# EAGLE design integrated_v1 (EAGLE 9.6.2)
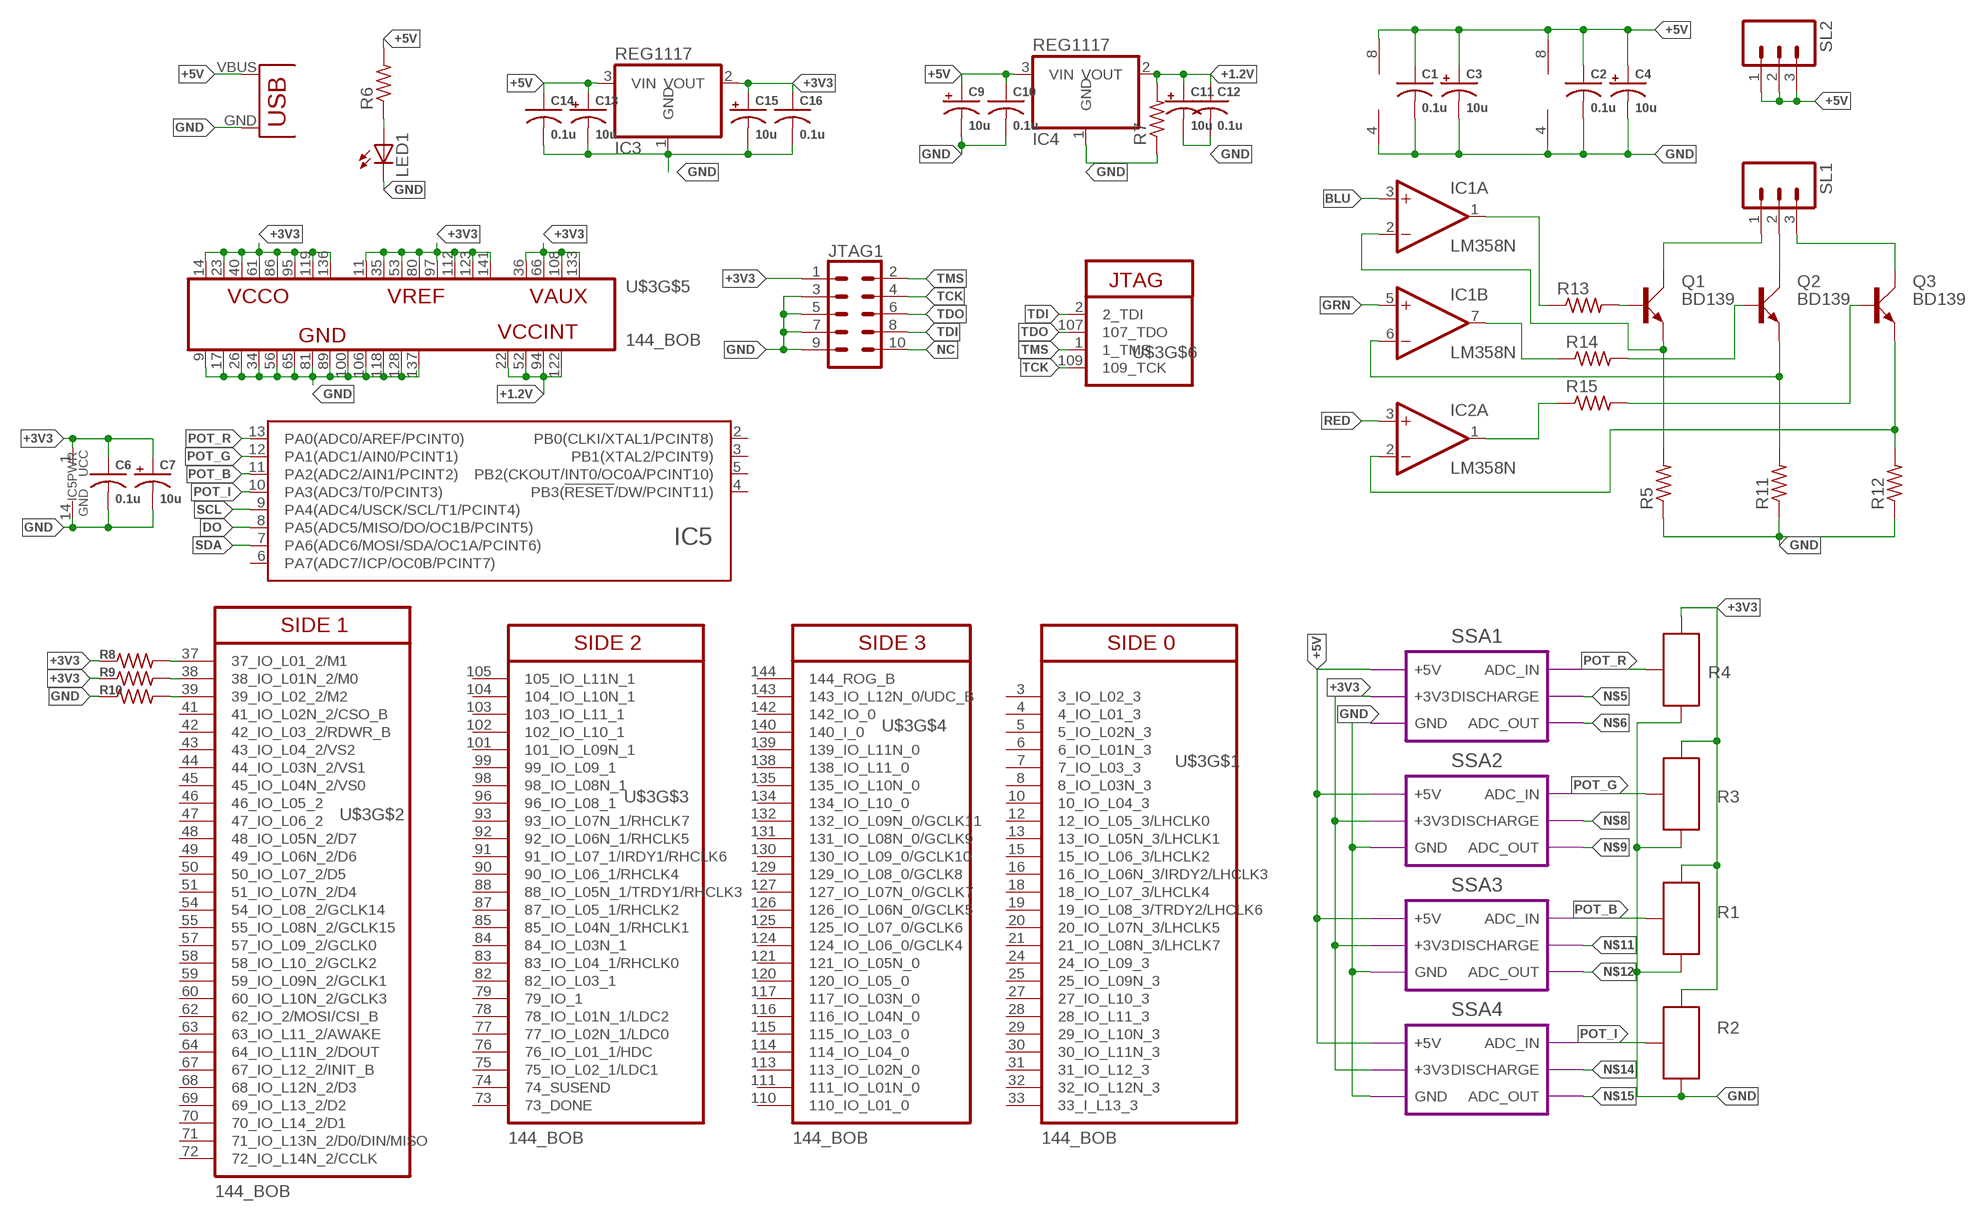
[diagram p0: schematic, sheet 1]

## Parts
C1  0.1u  CAP0603  [C0603]
C2  0.1u  CAP0603  [C0603]
C3  10u  CAP_POL_16V  [B/3528-21R]
C4  10u  CAP_POL_16V  [B/3528-21R]
C6  0.1u  CAP0603  [C0603]
C7  10u  CAP_POL_16V  [B/3528-21R]
C9  10u  CAP_POL_16V  [B/3528-21R]
C10  0.1u  CAP0603  [C0603]
C11  10u  CAP_POL_16V  [B/3528-21R]
C12  0.1u  CAP0603  [C0603]
C13  10u  CAP_POL_16V  [B/3528-21R]
C14  0.1u  CAP0603  [C0603]
C15  10u  CAP_POL_16V  [B/3528-21R]
C16  0.1u  CAP0603  [C0603]
IC1  LM358N  [DIL08]
IC2  LM358N  [DIL08]
IC3  REG1117  [SOT223]
IC4  REG1117  [SOT223]
IC5  ATTINY24/44/84-SSU  [SOIC14]
JTAG1  CONN_05X2  [2X5-SHROUDED_LOCK_PROPER]
LED1  LED3MM  [LED3MM]
Q1  BD139  [TO126AV]
Q2  BD139  [TO126AV]
Q3  BD139  [TO126AV]
R1  POTNORMAL  [RJ9W]
R2  POTNORMAL  [RJ9W]
R3  POTNORMAL  [RJ9W]
R4  POTNORMAL  [RJ9W]
R5  4.7  R-US_0411/15  [0411/15]
R6  R-US_0204/7  [0204/7]
R7  R-US_0204/7  [0204/7]
R8  RESISTOR0805  [R0805]
R9  RESISTOR0805  [R0805]
R10  RESISTOR0805  [R0805]
R11  R-US_0411/15  [0411/15]
R12  R-US_0411/15  [0411/15]
R13  R-US_0204/7  [0204/7]
R14  R-US_0204/7  [0204/7]
R15  R-US_0204/7  [0204/7]
SL1  M03  [03P]
SL2  M03  [03P]
U$3  144_BOB  [144_BOB]
U$4  USB(POWER)  [USB(POWER)]

## Module instances
SSA1 = SINGLESLOPEADC
SSA2 = SINGLESLOPEADC
SSA3 = SINGLESLOPEADC
SSA4 = SINGLESLOPEADC

## Nets
+1.2V: C11.+ C12.1 IC4.2(VOUT) R7.2 U$3.22(22_VCCINT) U$3.52(52_VCCINT) U$3.94(94_VCCINT) U$3.122(122_VCCINT)
+3V3: C6.1 C7.+ C15.+ C16.1 IC3.2(VOUT) IC5.1(UCC) JTAG1.1 R1.E R2.E R3.E R4.E R8.1 R9.1 U$3.11(11_VREF) U$3.14(14_VCCO) U$3.23(23_VCCO) U$3.35(35_VREF) U$3.36(36_VAUX) U$3.40(40_VCCO) U$3.53(53_VREF) U$3.61(61_VCCO) U$3.66(66_VAUX) U$3.80(80_VREF) U$3.86(86_VCCO) U$3.95(95_VCCO) U$3.97(97_VREF) U$3.108(108_VAUX) U$3.112(112_VREF) U$3.119(119_VCCO) U$3.123(123_VREF) U$3.133(133_VAUX) U$3.136(136_VCCO) U$3.141(141_VREF) ; port SSA1.+3V3 SSA2.+3V3 SSA3.+3V3 SSA4.+3V3
+5V: C1.1 C2.1 C3.+ C4.+ C9.+ C10.1 C13.+ C14.1 IC1.8(P:V+) IC2.8(P:V+) IC3.3(VIN) IC4.3(VIN) R6.2 SL2.1 SL2.2 SL2.3 U$4.VBUS(VCC) ; port SSA1.+5V SSA2.+5V SSA3.+5V SSA4.+5V
BLU: IC1.3(A:+IN)
DO: IC5.8(PA5(ADC5/MISO/DO/OC1B/PCINT5))
GND: C1.2 C2.2 C3.- C4.- C6.2 C7.- C9.- C10.2 C11.- C12.2 C13.- C14.2 C15.- C16.2 IC1.4(P:V-) IC2.4(P:V-) IC3.1(GND) IC4.1(GND) IC5.14(GND) JTAG1.3 JTAG1.5 JTAG1.7 JTAG1.9 LED1.K(C) R1.A R2.A R3.A R4.A R5.1 R7.1 R10.1 R11.1 R12.1 U$3.9(9_GND) U$3.17(17_GND) U$3.26(26_GND) U$3.34(34_GND) U$3.56(56_GND) U$3.65(65_GND) U$3.81(81_GND) U$3.89(89_GND) U$3.100(100_GND) U$3.106(106_GND) U$3.118(118_GND) U$3.128(128_GND) U$3.137(137_GND) U$4.GND ; port SSA1.GND SSA3.GND SSA4.GND SSA2.GND
GRN: IC1.5(B:+IN)
N$1: Q1.C SL1.1
N$2: Q3.C SL1.3
N$3: Q2.C SL1.2
N$5: port SSA1.DISCHARGE
N$6: port SSA1.ADC_OUT
N$8: port SSA2.DISCHARGE
N$9: port SSA2.ADC_OUT
N$11: port SSA3.DISCHARGE
N$12: port SSA3.ADC_OUT
N$14: port SSA4.DISCHARGE
N$15: port SSA4.ADC_OUT
N$16: Q1.B R13.2
N$17: Q2.B R14.2
N$18: Q3.B R15.2
N$19: IC1.6(B:-IN) Q2.E R11.2
N$20: IC1.1(A:OUT) R13.1
N$21: IC1.7(B:OUT) R14.1
N$22: IC2.1(A:OUT) R15.1
N$23: IC1.2(A:-IN) Q1.E R5.2
N$24: LED1.A R6.1
N$25: R8.2 U$3.37(37_IO_L01_2/M1)
N$26: R9.2 U$3.38(38_IO_L01N_2/M0)
N$27: R10.2 U$3.39(39_IO_L02_2/M2)
N$32: IC2.2(A:-IN) Q3.E R12.2
NC: JTAG1.10
POT_B: IC5.11(PA2(ADC2/AIN1/PCINT2)) R1.S ; port SSA3.ADC_IN
POT_G: IC5.12(PA1(ADC1/AIN0/PCINT1)) R3.S ; port SSA2.ADC_IN
POT_I: IC5.10(PA3(ADC3/T0/PCINT3)) R2.S ; port SSA4.ADC_IN
POT_R: IC5.13(PA0(ADC0/AREF/PCINT0)) R4.S ; port SSA1.ADC_IN
RED: IC2.3(A:+IN)
SCL: IC5.9(PA4(ADC4/USCK/SCL/T1/PCINT4))
SDA: IC5.7(PA6(ADC6/MOSI/SDA/OC1A/PCINT6))
TCK: JTAG1.4 U$3.109(109_TCK)
TDI: JTAG1.8 U$3.2(2_TDI)
TDO: JTAG1.6 U$3.107(107_TDO)
TMS: JTAG1.2 U$3.1(1_TMS)
Unconnected: IC2.5(B:+IN) IC2.6(B:-IN) IC2.7(B:OUT) IC5.2(PB0(CLKI/XTAL1/PCINT8)) IC5.3(PB1(XTAL2/PCINT9)) IC5.4(PB3(!RESET!/DW/PCINT11)) IC5.5(PB2(CKOUT/INT0/OC0A/PCINT10)) IC5.6(PA7(ADC7/ICP/OC0B/PCINT7)) U$3.3(3_IO_L02_3) U$3.4(4_IO_L01_3) U$3.5(5_IO_L02N_3) U$3.6(6_IO_L01N_3) U$3.7(7_IO_L03_3) U$3.8(8_IO_L03N_3) U$3.10(10_IO_L04_3) U$3.12(12_IO_L05_3/LHCLK0) U$3.13(13_IO_L05N_3/LHCLK1) U$3.15(15_IO_L06_3/LHCLK2) U$3.16(16_IO_L06N_3/IRDY2/LHCLK3) U$3.18(18_IO_L07_3/LHCLK4) U$3.19(19_IO_L08_3/TRDY2/LHCLK6) U$3.20(20_IO_L07N_3/LHCLK5) U$3.21(21_IO_L08N_3/LHCLK7) U$3.24(24_IO_L09_3) U$3.25(25_IO_L09N_3) U$3.27(27_IO_L10_3) U$3.28(28_IO_L11_3) U$3.29(29_IO_L10N_3) U$3.30(30_IO_L11N_3) U$3.31(31_IO_L12_3) U$3.32(32_IO_L12N_3) U$3.33(33_I_L13_3) U$3.41(41_IO_L02N_2/CSO_B) U$3.42(42_IO_L03_2/RDWR_B) U$3.43(43_IO_L04_2/VS2) U$3.44(44_IO_L03N_2/VS1) U$3.45(45_IO_L04N_2/VS0) U$3.46(46_IO_L05_2) U$3.47(47_IO_L06_2) U$3.48(48_IO_L05N_2/D7) U$3.49(49_IO_L06N_2/D6) U$3.50(50_IO_L07_2/D5) U$3.51(51_IO_L07N_2/D4) U$3.54(54_IO_L08_2/GCLK14) U$3.55(55_IO_L08N_2/GCLK15) U$3.57(57_IO_L09_2/GCLK0) U$3.58(58_IO_L10_2/GCLK2) U$3.59(59_IO_L09N_2/GCLK1) U$3.60(60_IO_L10N_2/GCLK3) U$3.62(62_IO_2/MOSI/CSI_B) U$3.63(63_IO_L11_2/AWAKE) U$3.64(64_IO_L11N_2/DOUT) U$3.67(67_IO_L12_2/INIT_B) U$3.68(68_IO_L12N_2/D3) U$3.69(69_IO_L13_2/D2) U$3.70(70_IO_L14_2/D1) U$3.71(71_IO_L13N_2/D0/DIN/MISO) U$3.72(72_IO_L14N_2/CCLK) U$3.73(73_DONE) U$3.74(74_SUSEND) U$3.75(75_IO_L02_1/LDC1) U$3.76(76_IO_L01_1/HDC) U$3.77(77_IO_L02N_1/LDC0) U$3.78(78_IO_L01N_1/LDC2) U$3.79(79_IO_1) U$3.82(82_IO_L03_1) U$3.83(83_IO_L04_1/RHCLK0) U$3.84(84_IO_L03N_1) U$3.85(85_IO_L04N_1/RHCLK1) U$3.87(87_IO_L05_1/RHCLK2) U$3.88(88_IO_L05N_1/TRDY1/RHCLK3) U$3.90(90_IO_L06_1/RHCLK4) U$3.91(91_IO_L07_1/IRDY1/RHCLK6) U$3.92(92_IO_L06N_1/RHCLK5) U$3.93(93_IO_L07N_1/RHCLK7) U$3.96(96_IO_L08_1) U$3.98(98_IO_L08N_1) U$3.99(99_IO_L09_1) U$3.101(101_IO_L09N_1) U$3.102(102_IO_L10_1) U$3.103(103_IO_L11_1) U$3.104(104_IO_L10N_1) U$3.105(105_IO_L11N_1) U$3.110(110_IO_L01_0) U$3.111(111_IO_L01N_0) U$3.113(113_IO_L02N_0) U$3.114(114_IO_L04_0) U$3.115(115_IO_L03_0) U$3.116(116_IO_L04N_0) U$3.117(117_IO_L03N_0) U$3.120(120_IO_L05_0) U$3.121(121_IO_L05N_0) U$3.124(124_IO_L06_0/GCLK4) U$3.125(125_IO_L07_0/GCLK6) U$3.126(126_IO_L06N_0/GCLK5) U$3.127(127_IO_L07N_0/GCLK7) U$3.129(129_IO_L08_0/GCLK8) U$3.130(130_IO_L09_0/GCLK10) U$3.131(131_IO_L08N_0/GCLK9) U$3.132(132_IO_L09N_0/GCLK11) U$3.134(134_IO_L10_0) U$3.135(135_IO_L10N_0) U$3.138(138_IO_L11_0) U$3.139(139_IO_L11N_0) U$3.140(140_I_0) U$3.142(142_IO_0) U$3.143(143_IO_L12N_0/UDC_B) U$3.144(144_ROG_B)

## Library data of the parts
C1 C2 C6 C10 C12 C14 C16 = CEDT_JANUARY_2015_v5:CAP
C3 C4 C7 C9 C11 C13 C15 = CEDT_JANUARY_2015_v5:CAP_POL
IC1 IC2 = CEDT_JANUARY_2015:LM358: OP AMP also LM158; LM258; LM2904 Source: http://cache.national.com/ds/LM/LM158.pdf
IC3 IC4 = CEDT_JANUARY_2015_v5:REG1117: 800mA and 1A Low Dropout (LDO) Positive Regulator 1.8V, 2.5V, 2.85V, 3.3V, 5V, and Adj
IC5 = atmel_tiny24-44-84tiny48-88mega48-88-168-328:ATTINY24/44/84
JTAG1 = SparkFun-Connectors_v3:CONN_05X2: Multi connection point. Often used as Generic Header-pin footprint for 0.1 inch spaced/style header connections For AVR SPI programming port, see special device with nice symbol: "AVR_SPI_PROG_5x2.dev" You can populate with any combo of single row headers, but if you'd like an exact match, check these: 2x5 AVR ICSP Male Header (PRT-00778) 2x5 Pin Shrouded Header (PRT-08506) On any of the 0.1 inch spaced packages, you can populate with these: Break Away Headers - Straight (PRT-00116) Break Away Male Headers - Right Angle (PRT-00553) Female Headers (PRT-00115) Break Away Headers - Machine Pin (PRT-00117) Break Away Female Headers - Swiss Machine Pin (PRT-00743) Special note: the shrouded connector mates well with our 5x2 ribbon cables: 2x5 Pin IDC Ribbon Cable (PRT-08535)
LED1 = CEDT_JANUARY_2015_v5:LED
Q1-Q3 = transistor-power:BD139: NPN TRANSISTOR
R1-R4 = CEDTv78:POT
R5 R11-R15 = resistor:R-US_: RESISTOR, American symbol
R6 R7 = rcl:R-US_: RESISTOR, American symbol; SPICEPREFIX: R
R8-R10 = CEDT_JANUARY_2015_v5:RESISTOR
SL1 SL2 = con-amp-quick:M03: AMP QUICK CONNECTOR; OC_FARNELL: unknown; OC_NEWARK: unknown
U$3 = Suprio_Lib:144_BOB
U$4 = CEDT_JANUARY_2015_v5:USB(POWER)

## Module SINGLESLOPEADC
Ports: +5V(pwr) +3V3(pwr) GND(pwr) ADC_IN(in) DISCHARGE(in) ADC_OUT(out)
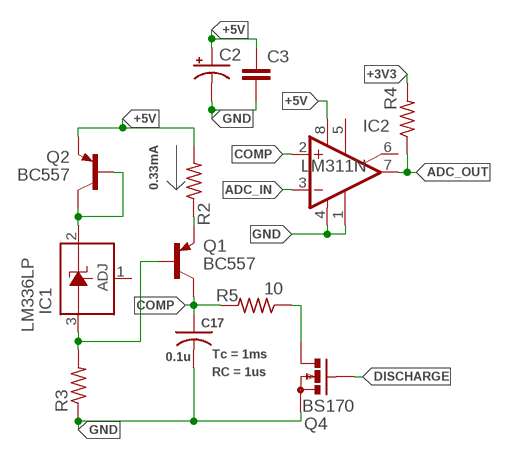
[diagram p1: schematic, module SINGLESLOPEADC, sheet 1]

### Parts
C2  CPOL-USE2.5-5  [E2,5-5]
C3  C-EU025-024X044  [C025-024X044]
C17  0.1u  CAP0603  [C0603]
IC1  LM336LP  [TO92]
IC2  LM311N  [DIL08]
Q1  BC557  PNP_BC557*TO92  [TO92]
Q2  BC557  PNP_BC557*TO92  [TO92]
Q4  BS170  [SOT54E]
R2  R-US_0204/7  [0204/7]
R3  R-US_0204/7  [0204/7]
R4  R-US_0204/7  [0204/7]
R5  10  RESISTOR0207/7  [0207/7]

### Nets
+3V3: R4.2
+5V: C2.+ C3.1 IC2.8(V+) Q2.3(E) R2.2
ADC_IN: IC2.3(-IN)
ADC_OUT: IC2.7(OUT) R4.1
COMP: C17.1 IC2.2(+IN) Q1.1(C) R5.2
DISCHARGE: Q4.G
GND: C2.- C3.2 C17.2 IC2.1(GND) IC2.4(V-) Q4.S R3.1
N$2: Q1.3(E) R2.1
N$3: IC1.2(C) Q2.1(C) Q2.2(B)
N$4: IC1.3(A) Q1.2(B) R3.2
N$5: Q4.D R5.1
Unconnected: IC1.1(ADJ) IC2.5(ON) IC2.6(ON/STR)

### Notes on the sheet
- 0.33mA
- Tc = 1ms
- RC = 1us

### Library data of the parts
C2 = rcl:CPOL-US: POLARIZED CAPACITOR, American symbol; SPICEPREFIX: C
C3 = rcl:C-EU: CAPACITOR, European symbol; SPICEPREFIX: C
C17 = CEDT_JANUARY_2015_v5:CAP
IC1 = linear:LM336: 2.5-V INTEGRATED REFERENCE CIRCUITS LM236 Source: http://focus.ti.com/lit/ds/symlink/lm336-2.5.pdf
IC2 = linear:LM311: COMPARATOR
Q1 Q2 = Transistor:PNP_: PNP - Popular parts; CATEGORY: Transistor; SUB-CATEGORY: BJT; TYPE: PNP
Q4 = transistor-small-signal:BS170: N-CHANNEL MOS FET
R2-R4 = rcl:R-US_: RESISTOR, American symbol; SPICEPREFIX: R
R5 = CEDT_JANUARY_2015_v5 (1):RESISTOR

## Net classes
0 default: width 0.406 mm

## Board
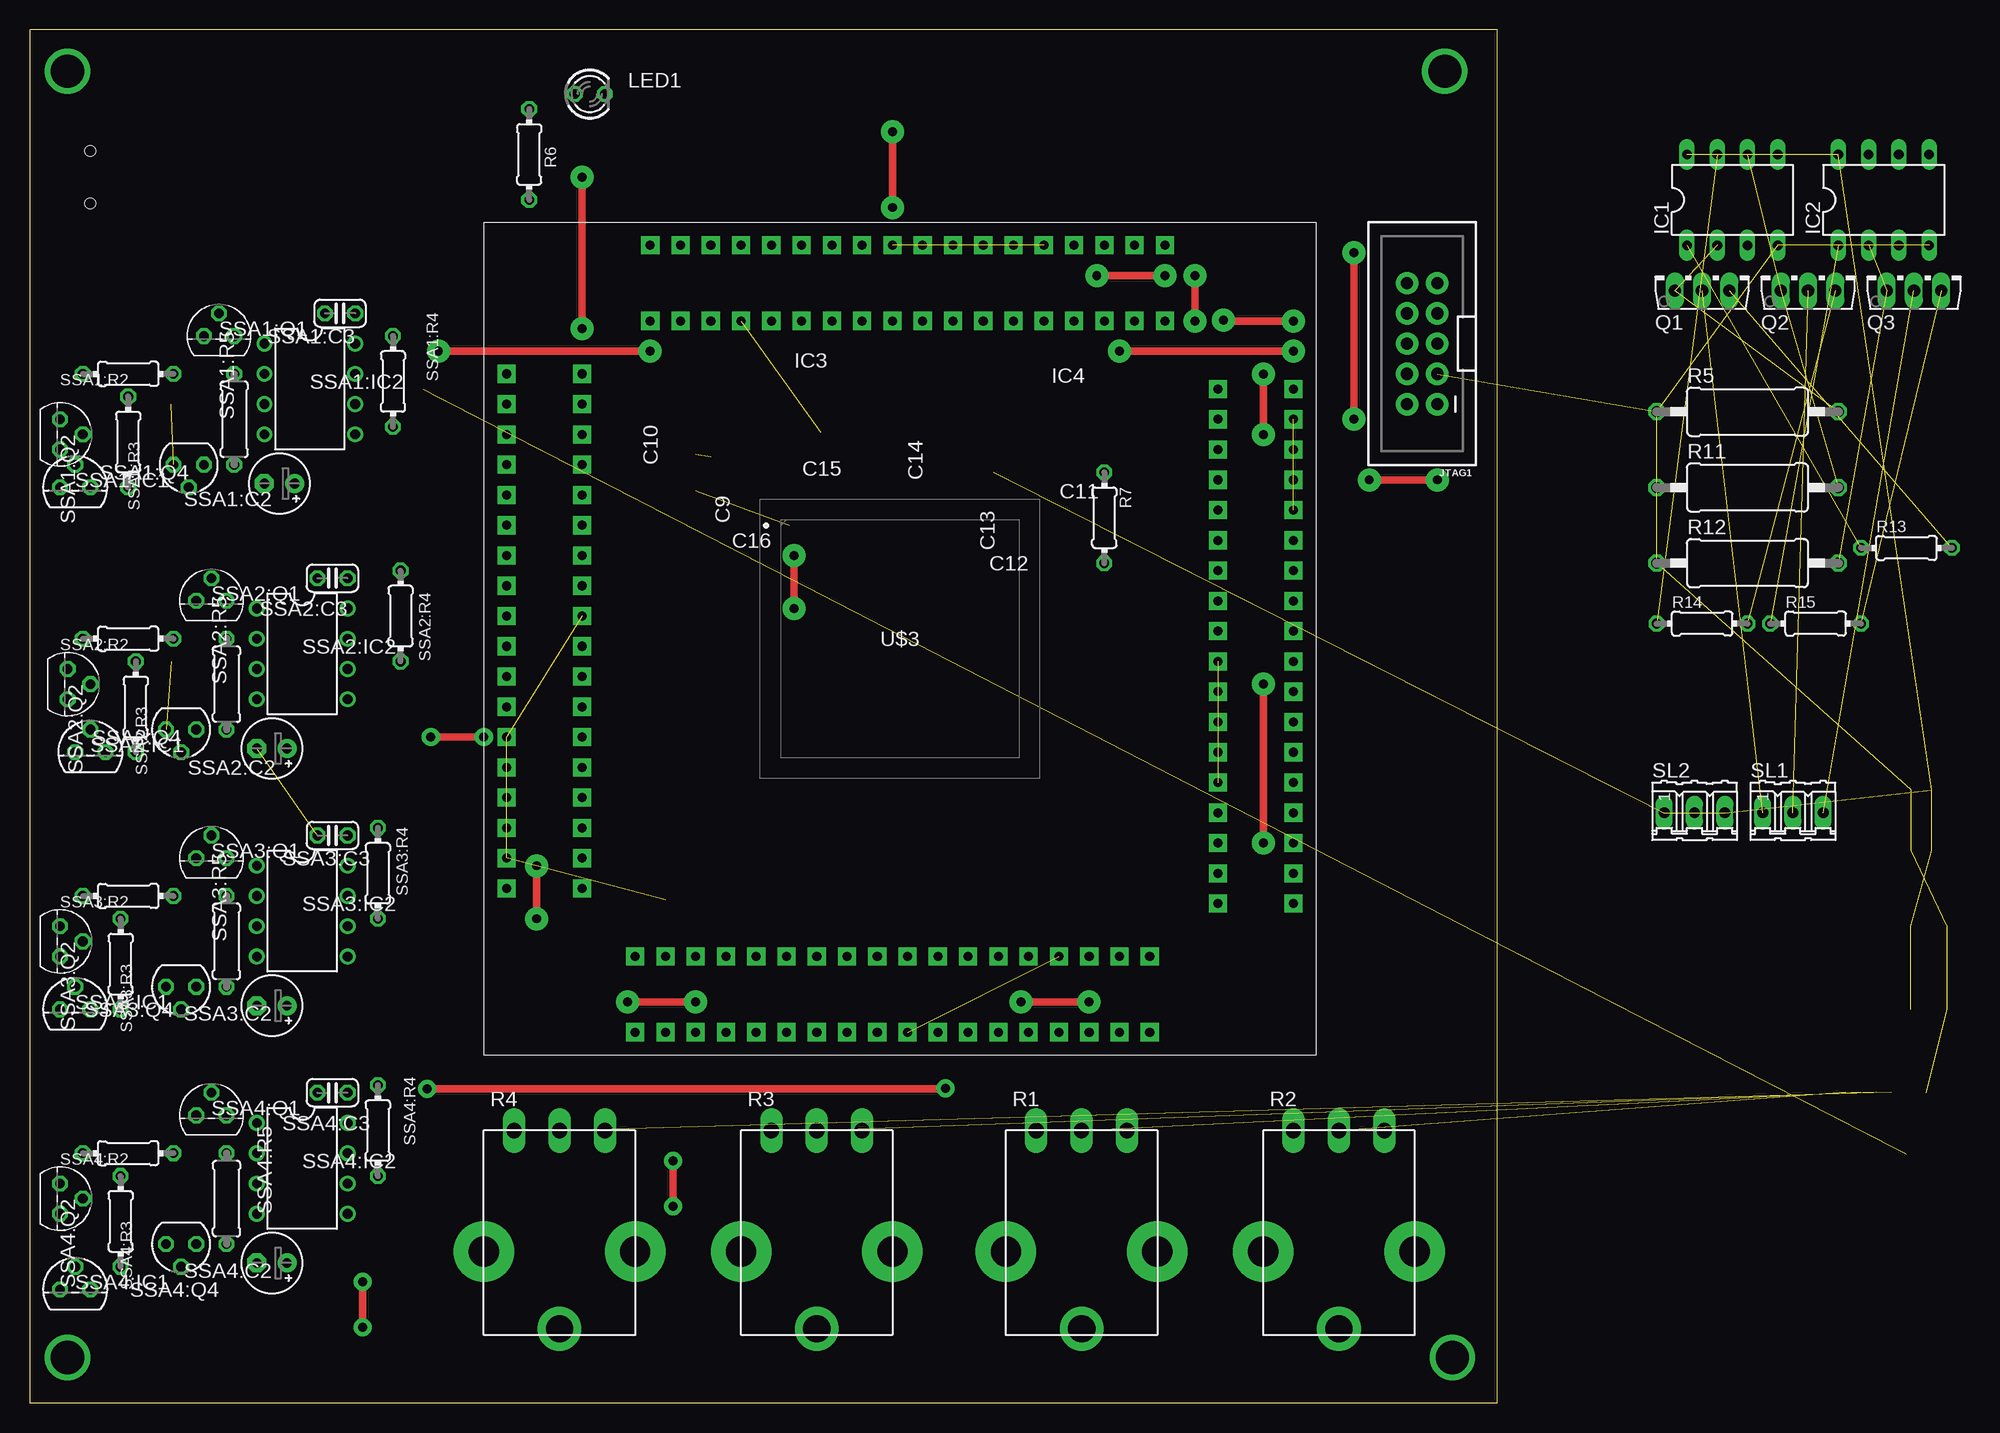
[diagram p2: board, top side]
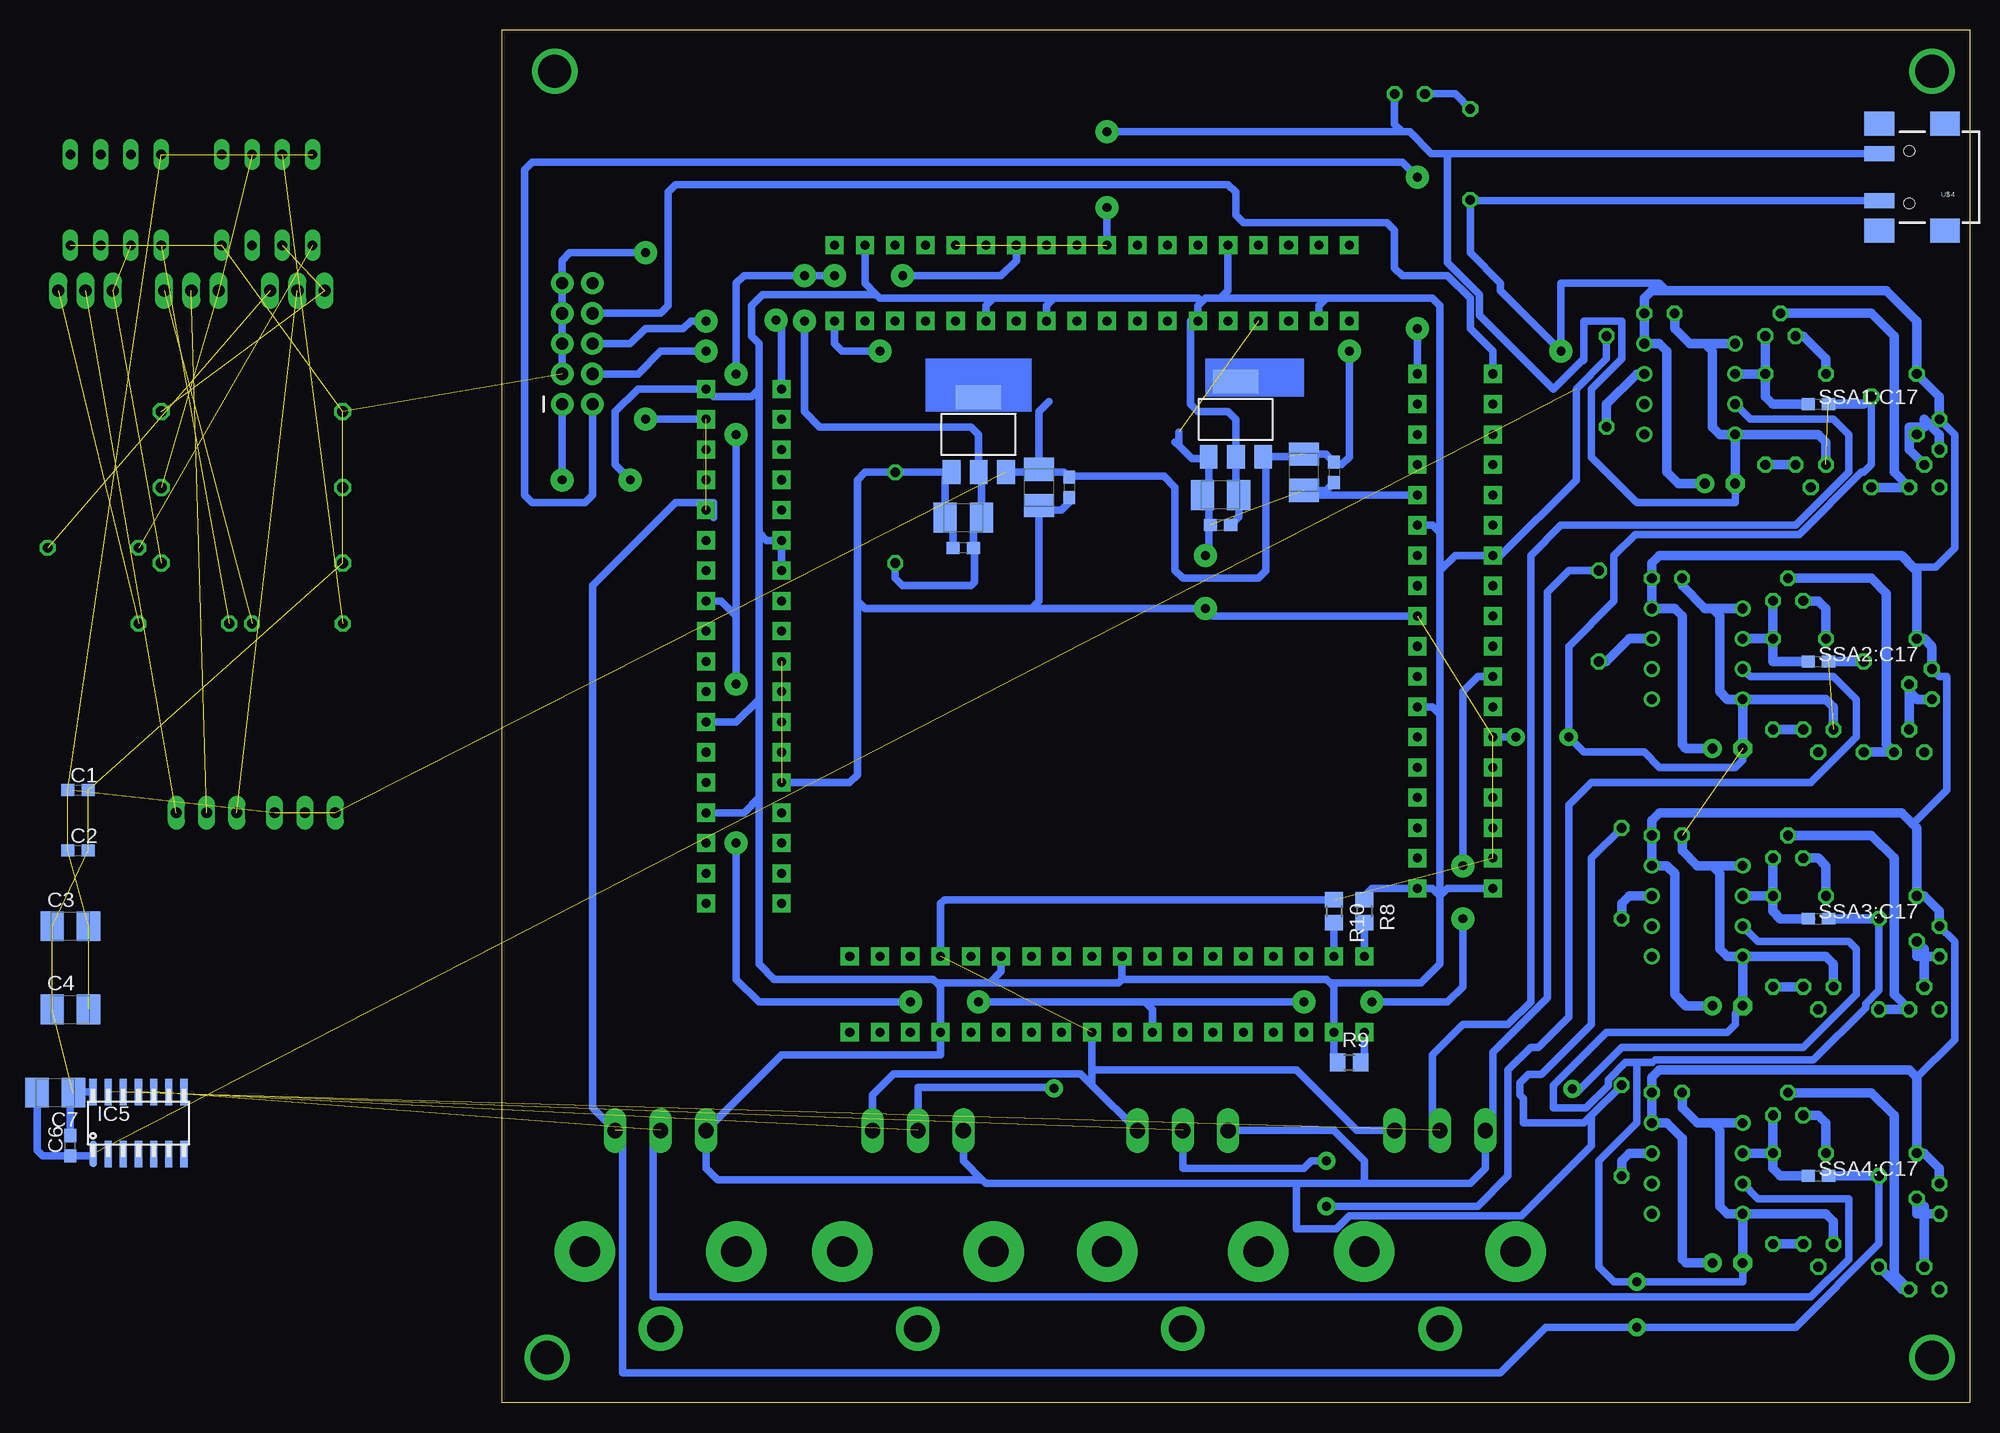
[diagram p3: board, bottom side, seen from below]

Size 123.17 x 115.24 mm. Coordinates in mm from the lower left corner, seen from the top.
Outline: 0,0 123.17,0 123.17,115.24 0,115.24 0,0
Copper layers (1*16): Top 0.035mm / dielectric 1.5mm / Bottom 0.035mm
Design rules "default": minimum track width 6mil, minimum drill 0.35mm, track to track 6mil, track to pad 6mil, pad to pad 6mil, via to via 6mil, smd to smd 6mil, copper to edge 40mil, drill to drill 6mil, minimum pad ring 10mil, minimum via ring 8mil, stop-mask expansion 4mil, vias tented up to drill 0mil, thermal gap 10mil

### Footprints (pad centres in the part's own frame; a part is rotated, then mirrored left to right if it is on the bottom)
C0603 = smd 1.1 x 1: 1 -0.85,0; 2 0.85,0
B/3528-21R = smd 1.95 x 2.5: + 1.525,0; - -1.525,0
DIL08 = drill 0.813 long: 1 -3.81,-3.81; 2 -1.27,-3.81; 3 1.27,-3.81; 4 3.81,-3.81; 5 3.81,3.81; 6 1.27,3.81; 7 -1.27,3.81; 8 -3.81,3.81
SOT223 = smd 1.499 x 2.007: 1 -2.261,-3.15; 2 0.025,-3.15; 3 2.311,-3.15 | smd 3.81 x 2.007: 4 0,3.15
SOIC14 = smd 0.61 x 2.21: 1 -3.81,-2.603; 2 -2.54,-2.603; 3 -1.27,-2.603; 4 0,-2.603; 5 1.27,-2.603; 6 2.54,-2.603; 7 3.81,-2.603; 8 3.81,2.603; 9 2.54,2.603; 10 1.27,2.603; 11 0,2.603; 12 -1.27,2.603; 13 -2.54,2.603; 14 -3.81,2.603
2X5-SHROUDED_LOCK_PROPER = drill 1.016 pad 1.88: 1 -1.27,5.08; 2 1.27,5.08; 3 -1.27,2.54; 4 1.27,2.54; 5 -1.27,0; 6 1.27,0; 7 -1.27,-2.54; 8 1.27,-2.54; 9 -1.27,-5.08; 10 1.27,-5.08
LED3MM = drill 0.813 octagon: A -1.27,0; K 1.27,0
TO126AV = drill 1.016 long: B 2.286,-1.27; C 0,-1.27; E -2.286,-1.27
RJ9W = drill 1.27 long: A 3.81,8.255; E -3.81,8.255; S 0,8.255 | drill 2.286 pad 3.658: P$1 0,-8.382 | drill 2.54 pad 5.08: P$3 6.35,-1.905; P$4 -6.35,-1.905
0411/15 = drill 0.914 octagon: 1 -7.62,0; 2 7.62,0
0204/7 = drill 0.813 octagon: 1 -3.81,0; 2 3.81,0
R0805 = smd 1.3 x 1.5: 1 -0.95,0; 2 0.95,0
03P = drill 0.914 long: 1 -2.54,0; 2 0,0; 3 2.54,0
E2,5-5 = drill 0.813 pad 1.6: + -1.27,0 | drill 0.813 pad 1.6 octagon: - 1.27,0
C025-024X044 = drill 0.813 octagon: 1 -1.27,0; 2 1.27,0
TO92 = drill 0.813 octagon: 1 -1.27,0; 2 0,1.905; 3 1.27,0
DIL08' = drill 0.813 pad 1.27: 1 -3.81,-3.81; 2 -1.27,-3.81; 3 1.27,-3.81; 4 3.81,-3.81; 5 3.81,3.81; 6 1.27,3.81; 7 -1.27,3.81; 8 -3.81,3.81
TO92' = drill 0.813 octagon: 1 1.27,0; 2 0,1.905; 3 -1.27,0
SOT54E = drill 0.813 octagon: D -1.27,0; G 0,1.905; S 1.27,0
0207/7 = drill 0.813 octagon: 1 -3.81,0; 2 3.81,0
144_BOB = drill 0.762 pad 1.524 square: 1 -26.67,21.59; 2 -33.02,21.59; 3 -26.67,19.05; 4 -33.02,19.05; 5 -26.67,16.51; 6 -33.02,16.51; 7 -26.67,13.97; 8 -33.02,13.97; 9 -26.67,11.43; 10 -33.02,11.43; 11 -26.67,8.89; 12 -33.02,8.89; 13 -26.67,6.35; 14 -33.02,6.35; 15 -26.67,3.81; 16 -33.02,3.81; 17 -26.67,1.27; 18 -33.02,1.27; 19 -26.67,-1.27; 20 -33.02,-1.27; 21 -26.67,-3.81; 22 -33.02,-3.81; 23 -26.67,-6.35; 24 -33.02,-6.35; 25 -26.67,-8.89; 26 -33.02,-8.89; 27 -26.67,-11.43; 28 -33.02,-11.43; 29 -26.67,-13.97; 30 -33.02,-13.97; 31 -26.67,-16.51; 32 -33.02,-16.51; 33 -26.67,-19.05; 34 -33.02,-19.05; 35 -26.67,-21.59; 36 -33.02,-21.59; 37 -22.225,-27.305; 38 -22.225,-33.655; 39 -19.685,-27.305; 40 -19.685,-33.655; 41 -17.145,-27.305; 42 -17.145,-33.655; 43 -14.605,-27.305; 44 -14.605,-33.655; 45 -12.065,-27.305; 46 -12.065,-33.655; 47 -9.525,-27.305; 48 -9.525,-33.655; 49 -6.985,-27.305; 50 -6.985,-33.655; 51 -4.445,-27.305; 52 -4.445,-33.655; 53 -1.905,-27.305; 54 -1.905,-33.655; 55 0.635,-27.305; 56 0.635,-33.655; 57 3.175,-27.305; 58 3.175,-33.655; 59 5.715,-27.305; 60 5.715,-33.655; 61 8.255,-27.305; 62 8.255,-33.655; 63 10.795,-27.305; 64 10.795,-33.655; 65 13.335,-27.305; 66 13.335,-33.655; 67 15.875,-27.305; 68 15.875,-33.655; 69 18.415,-27.305; 70 18.415,-33.655; 71 20.955,-27.305; 72 20.955,-33.655; 73 26.67,-22.86; 74 33.02,-22.86; 75 26.67,-20.32; 76 33.02,-20.32; 77 26.67,-17.78; 78 33.02,-17.78; 79 26.67,-15.24; 80 33.02,-15.24; 81 26.67,-12.7; 82 33.02,-12.7; 83 26.67,-10.16; 84 33.02,-10.16; 85 26.67,-7.62; 86 33.02,-7.62; 87 26.67,-5.08; 88 33.02,-5.08; 89 26.67,-2.54; 90 33.02,-2.54; 91 26.67,0; 92 33.02,0; 93 26.67,2.54; 94 33.02,2.54; 95 26.67,5.08; 96 33.02,5.08; 97 26.67,7.62; 98 33.02,7.62; 99 26.67,10.16; 100 33.02,10.16; 101 26.67,12.7; 102 33.02,12.7; 103 26.67,15.24; 104 33.02,15.24; 105 26.67,17.78; 106 33.02,17.78; 107 26.67,20.32; 108 33.02,20.32; 109 22.225,26.035; 110 22.225,32.385; 111 19.685,26.035; 112 19.685,32.385; 113 17.145,26.035; 114 17.145,32.385; 115 14.605,26.035; 116 14.605,32.385; 117 12.065,26.035; 118 12.065,32.385; 119 9.525,26.035; 120 9.525,32.385; 121 6.985,26.035; 122 6.985,32.385; 123 4.445,26.035; 124 4.445,32.385; 125 1.905,26.035; 126 1.905,32.385; 127 -0.635,26.035; 128 -0.635,32.385; 129 -3.175,26.035; 130 -3.175,32.385; 131 -5.715,26.035; 132 -5.715,32.385; 133 -8.255,26.035; 134 -8.255,32.385; 135 -10.795,26.035; 136 -10.795,32.385; 137 -13.335,26.035; 138 -13.335,32.385; 139 -15.875,26.035; 140 -15.875,32.385; 141 -18.415,26.035; 142 -18.415,32.385; 143 -20.955,26.035; 144 -20.955,32.385
USB(POWER) = smd 2.54 x 1.27: GND 2.5,-1.981; VBUS 2.5,1.981 | smd 2.5 x 2: GND@1 -3,-4.5; GND@2 -3,4.5; GND@3 2.5,4.5; GND@4 2.5,-4.5 | hole 0.9: 0,2.2; 0,-2.2

### Placement (x,y rotation side)
C1  not placed on the board
C2  not placed on the board
C3  not placed on the board
C4  not placed on the board
C6  159.38,21.59 90 bottom  (outside the outline)
C7  160.66,26.04 180 bottom  (outside the outline)
C9  55.88,78.11 90 bottom
C10  53.34,78.11 270 bottom
C11  84.45,74.3 0 bottom
C12  84.45,71.75 180 bottom
C13  78.11,76.83 90 bottom
C14  75.56,76.83 270 bottom
C15  62.87,76.2 0 bottom
C16  62.87,73.66 180 bottom
IC1  not placed on the board
IC2  not placed on the board
IC3  61.59,82.55 0 bottom
IC4  83.19,81.28 0 bottom
IC5  153.67,23.5 0 bottom  (outside the outline)
JTAG1  116.84,88.9 180 top
LED1  46.99,109.86 0 top
Q1  not placed on the board
Q2  not placed on the board
Q3  not placed on the board
R1  88.27,14.61 0 top
R2  109.86,14.61 0 top
R3  66.04,14.61 0 top
R4  44.45,14.61 0 top
R5  not placed on the board
R6  41.91,104.78 270 top
R7  90.17,74.3 270 top
R8  50.8,41.27 270 bottom
R9  52.07,28.57 0 bottom
R10  53.34,41.27 270 bottom
R11  not placed on the board
R12  not placed on the board
R13  not placed on the board
R14  not placed on the board
R15  not placed on the board
SL1  not placed on the board
SL2  not placed on the board
SSA1:C2  [E2,5-5]  20.95,77.15 180 top
SSA1:C3  [C025-024X044]  26.04,91.44 180 top
SSA1:C17  0.1u  [C0603]  12.7,83.82 0 bottom
SSA1:IC1  LM336LP  [TO92]  3.81,76.83 0 top
SSA1:IC2  LM311N  [DIL08']  23.5,85.09 270 top
SSA1:Q1  BC557  [TO92']  15.88,89.53 0 top
SSA1:Q2  BC557  [TO92']  2.54,81.28 270 top
SSA1:Q4  BS170  [SOT54E]  13.34,78.74 180 top
SSA1:R2  [0204/7]  8.26,86.36 180 top
SSA1:R3  [0204/7]  8.26,80.64 270 top
SSA1:R4  [0204/7]  30.48,85.72 90 top
SSA1:R5  10  [0207/7]  17.14,82.55 90 top
SSA2:C2  [E2,5-5]  20.32,54.93 180 top
SSA2:C3  [C025-024X044]  25.4,69.22 180 top
SSA2:C17  0.1u  [C0603]  12.7,62.23 0 bottom
SSA2:IC1  LM336LP  [TO92]  5.08,54.61 0 top
SSA2:IC2  LM311N  [DIL08']  22.86,62.87 270 top
SSA2:Q1  BC557  [TO92']  15.24,67.31 0 top
SSA2:Q2  BC557  [TO92']  3.17,60.33 270 top
SSA2:Q4  BS170  [SOT54E]  12.7,56.52 180 top
SSA2:R2  [0204/7]  8.26,64.14 180 top
SSA2:R3  [0204/7]  8.89,58.42 270 top
SSA2:R4  [0204/7]  31.11,66.04 90 top
SSA2:R5  10  [0207/7]  16.51,60.33 90 top
SSA3:C2  [E2,5-5]  20.32,33.34 180 top
SSA3:C3  [C025-024X044]  25.4,47.62 180 top
SSA3:C17  0.1u  [C0603]  12.7,40.64 0 bottom
SSA3:IC1  LM336LP  [TO92]  3.81,33.02 0 top
SSA3:IC2  LM311N  [DIL08']  22.86,41.27 270 top
SSA3:Q1  BC557  [TO92']  15.24,45.72 0 top
SSA3:Q2  BC557  [TO92']  2.54,38.73 270 top
SSA3:Q4  BS170  [SOT54E]  12.7,34.92 180 top
SSA3:R2  [0204/7]  8.26,42.55 180 top
SSA3:R3  [0204/7]  7.62,36.83 270 top
SSA3:R4  [0204/7]  29.21,44.45 90 top
SSA3:R5  10  [0207/7]  16.51,38.73 90 top
SSA4:C2  [E2,5-5]  20.32,11.75 180 top
SSA4:C3  [C025-024X044]  25.4,26.04 180 top
SSA4:C17  0.1u  [C0603]  12.7,19.05 0 bottom
SSA4:IC1  LM336LP  [TO92]  3.81,9.53 0 top
SSA4:IC2  LM311N  [DIL08']  22.86,19.68 270 top
SSA4:Q1  BC557  [TO92']  15.24,24.13 0 top
SSA4:Q2  BC557  [TO92']  2.54,17.14 270 top
SSA4:Q4  BS170  [SOT54E]  12.7,13.34 180 top
SSA4:R2  [0204/7]  8.26,20.95 180 top
SSA4:R3  [0204/7]  7.62,15.24 270 top
SSA4:R4  [0204/7]  29.21,22.86 90 top
SSA4:R5  10  [0207/7]  16.51,17.14 90 top
U$3  73.03,64.77 0 top
U$4  5.08,102.87 180 bottom

### Tracks (layer width: path | path; a pad name or v marks a point on that pad's centre or on a via)
+1.2V  (via drill 0.75 pad 1.93)
  Top 0.61: v103.5,46.99 v103.5,60.33 | v103.5,81.28 v103.5,86.36 | v95.25,94.61 v89.53,94.61 | v83.19,33.66 v88.9,33.66 | v55.88,33.66 v50.16,33.66 | v42.55,40.64 v42.55,45.09 | v97.79,94.61 v97.79,90.81
  Bottom 0.61: v103.5,60.33 103.5,66.04 | 103.5,66.04 v103.5,81.28 | v103.5,86.36 103.5,93.98 102.87,94.61 v97.79,94.61 v95.25,94.61 | v89.53,94.61 81.28,94.61 80.01,95.89 U$3.122 | U$3.52 68.58,33.02 69.22,33.66 | 69.22,33.66 v83.19,33.66 | v88.9,33.66 101.6,33.66 103.5,35.56 v103.5,46.99 | 69.22,33.66 v55.88,33.66 | v50.16,33.66 43.81,33.66 42.55,34.92 v42.55,40.64 | v42.55,45.09 42.55,59.69 41.27,60.96 U$3.22 | IC4.2 83.19,78.11 | IC4.2 83.19,78.16 83.19,81.28 83.82,81.92 96.52,81.92 97.79,83.19 v97.79,90.81 | R7.2 90.17,69.22 89.53,68.58 83.82,68.58 83.5,68.9 83.5,71.65 C12.1 83.61,73.62 C11.+ 82.93,77.9 IC4.2 | U$3.94 104.78,67.31 103.5,66.04
+3V3  (via drill 0.75 pad 1.93)  (1 unrouted)
  Top 0.61: v118.11,77.47 v112.39,77.47
  Bottom 0.61: 62.87,92.71 62.23,93.34 U$3.136 | 62.87,92.71 64.14,92.71 64.45,92.39 | 64.45,92.39 64.77,92.08 64.77,91.44 | 64.77,91.44 U$3.133 | 64.45,92.39 64.77,92.71 76.83,92.71 | 76.83,92.71 77.47,92.08 U$3.123 | 76.83,92.71 81.92,92.71 | 81.92,92.71 82.55,92.08 U$3.119 | 81.92,92.71 91.44,92.71 91.76,93.03 | 91.76,93.03 92.71,93.98 U$3.112 | 91.76,93.03 101.28,93.03 102.23,92.08 102.23,89.53 101.6,88.9 101.6,85.09 | 101.6,85.09 102.23,84.45 105.41,84.45 U$3.108 111.76,85.09 113.67,83.19 113.67,78.74 v112.39,77.47 | 101.6,85.09 101.6,73.03 | 101.6,73.03 100.97,72.39 U$3.97 U$3.95 | 101.6,73.03 101.6,59.05 | 101.6,59.05 103.5,57.15 U$3.86 | 101.6,59.05 101.6,50.8 | 101.6,50.8 102.87,49.53 U$3.80 | 101.6,50.8 101.6,36.83 100.33,35.56 87,35.56 86.68,35.24 | 86.68,35.24 86.36,34.92 U$3.66 86.36,29.21 99.69,29.21 R2.E 106.05,19.68 105.09,18.73 82.87,18.73 | 86.68,35.24 82.23,35.24 | U$3.61 81.28,36.2 82.23,35.24 | 82.23,35.24 71.44,35.24 71.12,35.56 | U$3.53 71.12,35.56 | 53.66,35.24 53.98,35.56 71.12,35.56 | 53.66,35.24 53.34,34.92 U$3.40 53.34,28.89 R9.1 | 53.66,35.24 46.04,35.24 44.45,36.83 44.45,42.55 | 44.45,42.55 45.09,43.18 U$3.35 50.16,43.18 50.8,42.55 R8.1 | 44.45,42.55 43.81,43.18 U$3.36 | 44.45,42.55 44.45,57.78 | U$3.23 45.09,58.42 44.45,57.78 | 44.45,57.78 44.45,69.85 | 44.45,69.85 43.18,71.12 U$3.14 39.37,71.12 33.02,77.47 33.02,85.09 30.48,87.63 SSA1:R4.2 | 44.45,69.85 44.45,73.03 | 44.45,73.03 45.09,73.66 U$3.11 | 53.98,92.71 45.09,92.71 44.45,92.08 44.45,73.03 | 53.98,92.71 54.61,92.08 U$3.141 | 53.98,92.71 62.87,92.71 | IC3.2 61.59,79.38 | IC3.2 61.57,82.53 62.23,83.19 64.77,83.19 65.41,83.82 65.41,90.81 64.77,91.44
  Bottom 0.61: IC3.2 61.57,76.43 C15.+ 61.34,74.33 C16.1 | JTAG1.1 v118.11,77.47 | C7.+ 162.18,21.21 161.71,20.74 C6.1 157.63,20.74 IC5.1 | 50.8,18.41 41.91,18.41 40.64,19.68 R4.E 40.01,23.5 40.01,29.4 35.43,33.97 35.43,68.07 33.66,69.85 SSA2:R4.2 | 50.8,18.41 56.52,18.41 | 56.52,18.41 82.55,18.41 82.87,18.73 | R1.E 84.45,20.32 82.87,18.73 | 50.8,18.41 50.8,20.32 53.34,22.86 R3.E | SSA4:R4.2 31.75,24.13 | 31.75,24.13 31.75,21.59 37.64,15.7 52.04,15.7 53.13,14.61 56.52,14.61 56.52,18.41 | SSA3:R4.2 31.75,45.72 31.75,31.75 35.93,27.57 37.02,27.57 37.73,26.86 37.73,25.85 37.47,25.58 37.47,23.5 32.38,23.5 31.75,24.13
+5V  (via drill 0.75 pad 1.93)  (10 unrouted)
  Top 0.61: v34.29,88.27 v52.07,88.27
  Bottom 0.61: 57.17,79.4 59.05,79.4 | 59.05,79.4 IC3.3 | 59.05,79.4 59.05,69.85 59.69,69.22 66.04,69.22 66.67,69.85 66.67,76.83 67.63,77.79 75.46,77.79 C14.1 76.01,78.13 77.88,78.13 | U$4.VBUS 41.83,100.89 R6.2 41.91,96.52 39.37,93.98 39.37,93.34 v34.29,88.27 34.29,93.98 26.04,93.98 25.4,93.34 | C9.+ 54.02,79.63 C10.1 53.12,78.74 52.7,78.74 52.07,79.38 v52.07,88.27 | 77.88,78.13 IC4.3 | 77.88,78.13 C13.+ 78.11,83.19 77.25,84.03 | SSA1:Q2.3 1.27,81.28 1.27,71.75 2.86,70.17 4.76,70.17 | 4.76,48.58 1.91,51.44 1.91,60.96 2.54,60.96 SSA2:Q2.3 | 4.45,27.3 1.27,30.48 1.27,38.73 SSA3:Q2.3
  Bottom 0.813: SSA1:Q2.3 2.54,84.45 SSA1:R2.2 4.45,90.81 6.99,93.34 25.4,93.34 26.67,93.34 27.3,92.71 SSA1:C3.1 SSA1:IC2.8 26.04,88.9 25.4,88.27 25.4,78.11 24.45,77.15 SSA1:C2.+ | SSA2:Q2.3 3.17,63.5 3.81,64.14 SSA2:R2.2 4.45,69.85 4.76,70.17 5.71,71.12 26.04,71.12 26.67,70.48 SSA2:C3.1 SSA2:IC2.8 24.77,66.67 24.13,66.04 24.13,55.24 23.81,54.93 SSA2:C2.+ | SSA3:Q2.3 2.54,41.27 3.81,42.55 SSA3:R2.2 4.45,48.26 4.76,48.58 5.71,49.53 26.04,49.53 26.67,48.9 SSA3:C3.1 SSA3:IC2.8 25.4,45.09 24.77,44.45 24.77,34.29 23.81,33.34 SSA3:C2.+ | SSA4:Q2.3 2.54,19.68 3.81,20.95 SSA4:R2.2 4.45,27.3 5.08,27.94 26.04,27.94 26.67,27.3 SSA4:C3.1 SSA4:IC2.8 25.4,23.5 24.13,22.23 24.13,12.06 23.81,11.75 SSA4:C2.+
GND  (via drill 0.75 pad 1.52, 0.75 pad 1.93)  (23 unrouted)
  Top 0.61: v64.14,71.12 v64.14,66.67 | v72.39,106.68 v72.39,100.33 | v111.12,96.52 v111.12,82.55 | v38.1,55.88 v33.66,55.88 | v27.94,6.35 v27.94,10.16
  Bottom 0.61: 64.01,79.25 IC3.1 63.86,75.56 | 64.01,79.25 64.14,79.12 | U$3.17 63.5,66.04 v64.14,66.67 78.74,66.67 | U$4.GND 43.81,104.85 | 43.81,104.85 45.16,104.85 46.99,106.68 47.62,106.68 | v72.39,100.33 U$3.128 | 47.62,106.68 v72.39,106.68 | IC4.1 85.72,77.85 | IC4.1 90.14,78.13 R7.1 92.71,78.11 93.34,77.47 93.34,67.31 | 78.74,66.67 92.71,66.67 93.34,67.31 | 93.34,67.31 93.34,52.7 93.98,52.07 U$3.81 | C10.2 54.02,76.58 C9.- 55.88,76.2 U$3.9 | C14.2 75.56,75.56 76.2,74.93 77.72,74.93 C13.- 78.11,67.31 78.74,66.67 | C11.- 85.98,74.93 | 85.98,74.93 85.98,77.6 IC4.1 | C12.2 85.31,74.25 85.98,74.93 | 63.86,75.56 63.86,73.8 | 63.86,73.8 63.86,71.4 v64.14,71.12 | C16.2 63.86,73.8 | C15.- 64.39,76.1 63.86,75.56 | JTAG1.3 JTAG1.5 JTAG1.7 JTAG1.9 118.11,95.89 117.47,96.52 v111.12,96.52 | v111.12,82.55 U$3.106 | 47.62,106.68 48.26,107.31 LED1.K | R10.1 86.05,42.23 86.36,41.91 U$3.65 | IC5.14 159.07,26.1 C7.- 159.38,25.78 C6.2 | R2.A 115.57,24.77 115.57,68.58 108.58,75.56 105.41,75.56 105.41,74.3 U$3.100 | R3.A 73.66,26.67 | 73.66,26.67 74.61,27.62 90.3,27.62 92.08,25.84 R1.A | R4.A 51.44,22.86 56.52,27.94 73.66,27.94 | 73.66,26.67 73.66,27.94 | 73.66,27.94 U$3.56 | U$3.26 v38.1,55.88 | SSA4:C2.- 19.05,10.16 v27.94,10.16 29.84,10.16 31.11,11.43 31.11,20.32 27.94,23.5 27.94,28.57 | 113.03,22.86 113.03,2.54 39.37,2.54 35.56,6.35 v27.94,6.35 14.61,6.35 7.62,13.34 SSA4:R3.1 | SSA2:C2.- 19.05,53.98 19.68,53.34 26.04,53.34 27.3,54.61 32.38,54.61 v33.66,55.88 33.66,63.5 29.84,67.31 29.84,71.12 28.07,72.9 14.29,72.9 9.08,78.11 8.89,78.11 8.26,78.74 SSA1:R3.1 | SSA3:C2.- 19.68,32.7 19.68,31.75 20.32,31.11 30.48,31.11 34.92,26.67 34.92,24.77 32.19,24.77 30.33,26.63 30.33,27.13 28.89,28.57 27.94,28.57
  Bottom 0.61: 27.94,28.57 26.62,28.57 26.39,28.8 13.11,28.8 8.74,33.17 8.74,33.48 7.62,34.6 SSA3:R3.1 | SSA1:C2.- 19.68,75.56 27.94,75.56 31.75,79.38 31.75,85.09 29.21,87.63 29.21,90.81 32.38,90.81 32.38,87.52 32.43,87.48 32.54,87.48 34.92,85.09 41.15,91.31 41.15,93.03 43.81,95.69 43.81,104.85 | 66.67,80.64 66.36,80.33 | 66.36,80.33 65.28,79.25 64.01,79.25 | 66.36,80.33 66.36,81.5
  Bottom 0.813: SSA2:IC2.4 SSA2:C2.- | SSA3:C2.- SSA3:IC2.4 | SSA4:IC2.4 SSA4:C2.- | SSA1:R3.1 8.89,83.82 SSA1:C17.2 | SSA2:R3.1 SSA2:C17.2 | SSA3:R3.1 SSA3:C17.2 | SSA4:R3.1 SSA4:C17.2 | SSA4:C3.2 24.13,24.77 22.86,23.5 21.59,23.5 | SSA4:IC2.1 21.59,23.5 | SSA4:IC2.4 20.32,15.88 20.95,16.51 20.95,22.86 21.59,23.5 | SSA3:C3.2 24.13,46.35 22.86,45.09 21.59,45.09 | SSA3:IC2.1 21.59,45.09 | SSA3:IC2.4 20.32,37.47 20.95,38.1 20.95,44.45 21.59,45.09 | SSA2:IC2.1 21.59,66.67 | 21.59,66.67 22.23,66.67 24.13,68.58 SSA2:C3.2 | SSA2:IC2.4 20.32,59.05 20.95,59.69 20.95,66.04 21.59,66.67 | SSA1:IC2.1 22.23,88.9 | 22.23,88.9 23.5,88.9 24.77,90.17 SSA1:C3.2 | SSA1:IC2.4 SSA1:C2.- | SSA1:IC2.4 20.95,81.28 21.59,81.92 21.59,88.27 22.23,88.9 | SSA1:IC2.4 12.7,81.28 12.06,80.64 SSA1:Q4.S | SSA2:Q4.S 11.43,58.42 12.06,59.05 SSA2:IC2.4 | SSA3:Q4.S 11.43,36.83 12.06,37.47 SSA3:IC2.4 | SSA4:Q4.S 11.43,15.24 12.06,15.88 SSA4:IC2.4
N$1  (1 unrouted)
N$2  (1 unrouted)
N$3  (1 unrouted)
N$6
  Bottom 0.813: SSA1:IC2.7 27.94,86.36 30.48,83.82 SSA1:R4.1
N$9
  Bottom 0.813: SSA2:IC2.7 28.57,64.14 30.48,62.23 SSA2:R4.1
N$12
  Bottom 0.813: SSA3:IC2.7 28.57,42.55 29.21,41.91 SSA3:R4.1
N$15
  Bottom 0.813: SSA4:IC2.7 28.57,20.95 29.21,20.32 SSA4:R4.1
N$16  (1 unrouted)
N$17  (1 unrouted)
N$18  (1 unrouted)
N$19  (2 unrouted)
N$20  (1 unrouted)
N$21  (1 unrouted)
N$22  (1 unrouted)
N$23  (2 unrouted)
N$24
  Bottom 0.61: LED1.A 43.18,109.86 R6.1
N$25
  Bottom 0.61: R8.2 U$3.37
N$26
  Bottom 0.61: R9.2 50.8,28.89 U$3.38
N$27
  Bottom 0.61: R10.2 U$3.39
N$28  (via drill 2.79 pad 3.81)
  other vias: 118.75,111.76
N$29  (via drill 2.79 pad 3.81)
  other vias: 119.38,3.81
N$30  (via drill 2.79 pad 3.81)
  other vias: 3.17,111.76
N$31  (via drill 2.79 pad 3.81)
  other vias: 3.17,3.81
N$32  (2 unrouted)
POT_B  (via drill 0.75 pad 1.52)  (1 unrouted)
  Top 0.61: v76.83,26.4 76.78,26.35 v33.34,26.35
  Bottom 0.61: SSA3:IC2.3 17.78,38.73 10.16,38.73 9.53,38.1 9.53,34.29 13.97,29.84 29.21,29.84 33.02,26.04 v33.34,26.35 | v76.83,26.4 76.92,26.49 88.27,26.49 R1.S
POT_G  (via drill 0.75 pad 1.52)  (1 unrouted)
  Top 0.61: v53.98,16.51 v53.98,20.32
  Bottom 0.61: SSA2:IC2.3 18.41,60.96 11.43,60.96 9.53,59.05 9.53,55.88 13.34,52.07 31.75,52.07 33.66,50.16 33.66,32.38 36.2,29.84 36.83,29.84 38.73,27.94 38.73,19.05 41.27,16.51 v53.98,16.51 | v53.98,20.32 55.24,20.32 55.88,19.68 66.04,19.68 R3.S
POT_I  (1 unrouted)
  Bottom 0.61: SSA4:IC2.3 17.78,17.14 10.16,17.14 10.16,12.06 13.34,8.89 110.49,8.89 110.49,22.23 R2.S
POT_R  (1 unrouted)
  Bottom 0.61: SSA1:IC2.3 18.41,82.55 11.43,82.55 10.16,81.28 10.16,78.11 14.61,73.66 34.29,73.66 36.83,71.12 36.83,33.66 38.73,31.75 42.55,31.75 45.09,29.21 45.09,21.59 44.45,22.23 R4.S
SSA1:COMP
  Bottom 0.813: SSA1:R5.2 SSA1:IC2.2 | SSA1:Q1.1 SSA1:R5.2 | SSA1:R5.2 17.14,84.45 16.51,83.82 SSA1:C17.1
SSA1:N$2
  Bottom 0.813: SSA1:Q1.3 13.97,89.53 12.06,87.63 SSA1:R2.1
SSA1:N$3
  Bottom 0.813: SSA1:Q2.1 2.54,81.28 3.81,82.55 3.81,81.92 5.08,81.92 5.08,80.01 SSA1:IC1.2
SSA1:N$4
  Bottom 0.813: SSA1:R3.2 SSA1:IC1.3 6.35,78.11 6.35,89.53 8.26,91.44 SSA1:Q1.2
SSA1:N$5
  Bottom 0.813: SSA1:Q4.D SSA1:R5.1
SSA2:COMP
  Bottom 0.813: SSA2:R5.2 SSA2:IC2.2 | SSA2:Q1.1 SSA2:R5.2 | SSA2:C17.1 16.51,62.23 SSA2:R5.2
SSA2:N$2
  Bottom 0.813: SSA2:Q1.3 12.7,67.31 12.06,66.67 SSA2:R2.1
SSA2:N$3
  Bottom 0.813: SSA2:Q2.1 4.45,59.05 5.08,59.69 SSA2:Q2.2 SSA2:IC1.2
SSA2:N$4
  Bottom 0.813: SSA2:R3.2 SSA2:IC1.3 6.99,55.24 6.99,67.94 8.26,69.22 SSA2:Q1.2
SSA2:N$5
  Bottom 0.813: SSA2:Q4.D SSA2:R5.1
SSA3:COMP
  Bottom 0.813: SSA3:R5.2 SSA3:IC2.2 | SSA3:Q1.1 SSA3:R5.2 | 13.34,40.64 SSA3:C17.1 15.88,40.64 16.51,41.27 SSA3:R5.2
SSA3:N$2
  Bottom 0.813: SSA3:Q1.3 12.7,45.72 12.06,45.09 SSA3:R2.1
SSA3:N$3
  Bottom 0.813: SSA3:Q2.1 4.45,37.47 SSA3:Q2.2 3.81,38.1 SSA3:IC1.2
SSA3:N$4
  Bottom 0.813: SSA3:R3.2 SSA3:IC1.3 6.35,34.29 6.35,45.72 8.26,47.62 SSA3:Q1.2
SSA3:N$5
  Bottom 0.813: SSA3:Q4.D SSA3:R5.1
SSA4:COMP
  Bottom 0.813: SSA4:R5.2 SSA4:IC2.2 | SSA4:Q1.1 SSA4:R5.2 | SSA4:C17.1 15.88,19.05 16.51,19.68 SSA4:R5.2
SSA4:N$2
  Bottom 0.813: SSA4:Q1.3 12.7,24.13 12.06,23.5 SSA4:R2.1
SSA4:N$3
  Bottom 0.813: SSA4:Q2.1 4.45,15.88 SSA4:Q2.2 3.81,16.51 SSA4:IC1.2
SSA4:N$4
  Bottom 0.813: SSA4:R3.2 5.71,9.53 SSA4:IC1.3 6.35,10.79 6.35,24.13 8.26,26.04 SSA4:Q1.2
SSA4:N$5
  Bottom 0.813: SSA4:Q4.D SSA4:R5.1
TCK  (via drill 0.75 pad 1.93)
  Top 0.61: v106.05,88.27 v91.44,88.27
  Bottom 0.61: v91.44,88.27 94.61,88.27 95.25,88.9 U$3.109 | v106.05,88.27 109.86,88.27 111.76,86.36 JTAG1.4
TDI
  Bottom 0.61: JTAG1.8 109.86,91.44 109.22,92.08 109.22,101.6 108.58,102.23 62.23,102.23 61.59,101.6 61.59,99.69 60.96,99.06 48.9,99.06 48.26,98.42 48.26,95.25 47.62,94.61 43.81,94.61 41.91,92.71 41.91,90.17 40.01,88.27 U$3.2
TDO  (via drill 0.75 pad 1.93)
  Top 0.61: v106.05,90.81 100.25,90.81 v100.18,90.88
  Bottom 0.61: v106.05,90.81 107.31,90.81 107.95,90.17 111.12,90.17 112.39,88.9 JTAG1.6 | v100.18,90.88 99.69,90.4 U$3.107
TMS  (via drill 0.75 pad 1.93)
  Top 0.61: v46.35,102.87 v46.35,90.17
  Bottom 0.61: v46.35,90.17 U$3.1 | v46.35,102.87 47.62,104.14 120.65,104.14 121.28,103.5 121.28,76.2 120.65,75.56 116.2,75.56 115.57,76.2 JTAG1.2
(copper drawn outside any net)
  shapes: Bottom area x2